# EAGLE design LB_BIT_o1_LED-v02(rev1) (EAGLE 6.1)

## Sheet 1 of 2
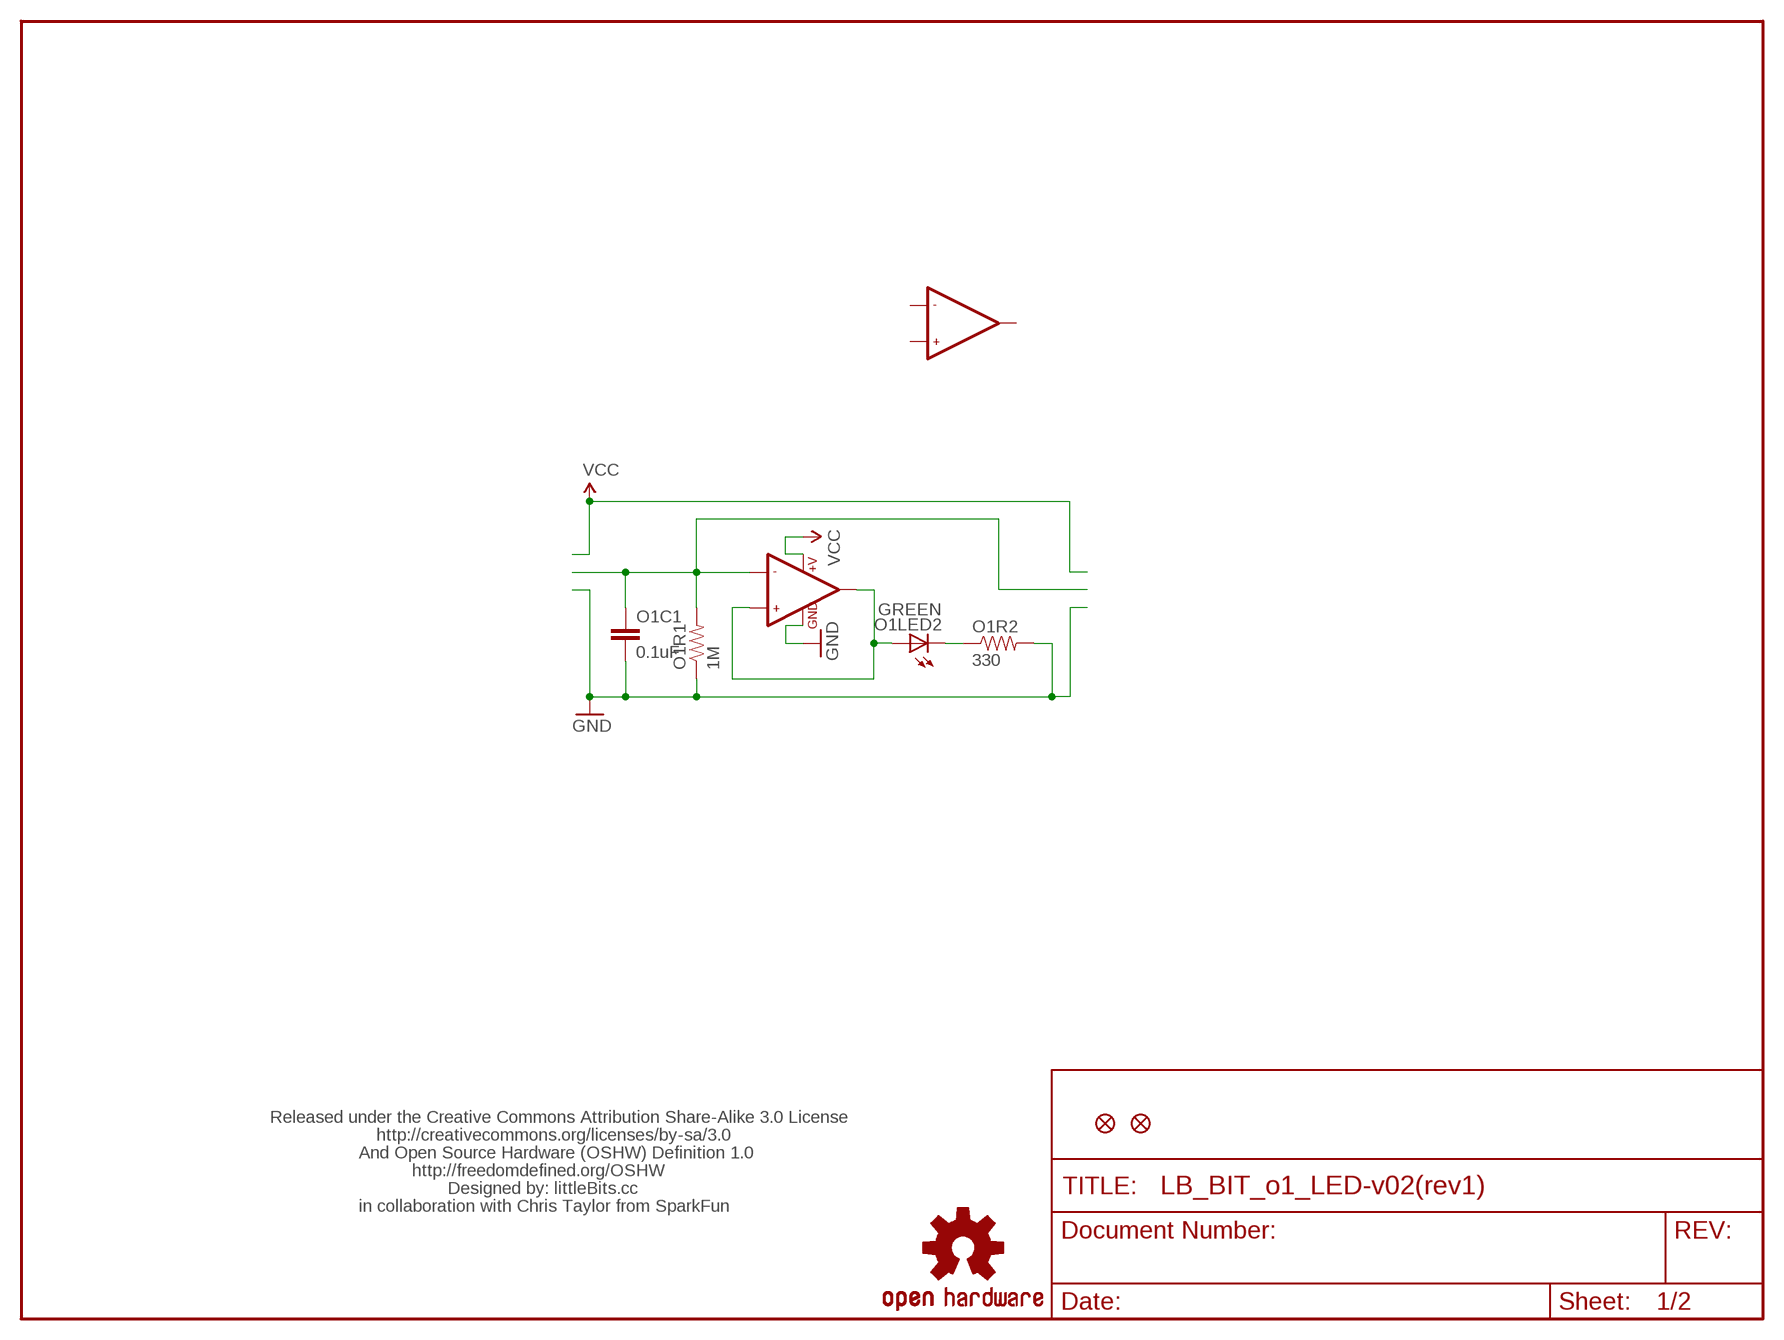
[diagram p0: schematic, sheet 1]

### Parts
JP1  FIDUCIAL1X2.5  [FIDUCIAL-1X2.5]
JP2  FIDUCIAL1X2.5  [FIDUCIAL-1X2.5]
O1C1  0.1uF  CAP1206  [1206]
O1LED2  GREEN  LED1206  [LED-1206]
O1R1  1M  RESISTOR  [0805]
O1R2  330  RESISTOR  [0805]
U$1  LB_CREDITS  [OSHWCREDIT]
U$3  OSHW-LOGOL  [OSHW-LOGO-L]
U$7  LMV358  [SO08]

### Nets
GND: O1C1.2 O1R1.1 O1R2.2 U$7.4(GND) ; also sheet 2
LEDGND: O1LED2.C O1R2.1
N$1: O1LED2.A U$7.1(OUT1) U$7.3(+IN1)
SIG: O1C1.1 O1R1.2 U$7.2(-IN1) ; also sheet 2
VCC: U$7.8(+V) ; also sheet 2
Unconnected: U$7.5(+IN2) U$7.6(-IN2) U$7.7(OUT2)

## Sheet 2 of 2
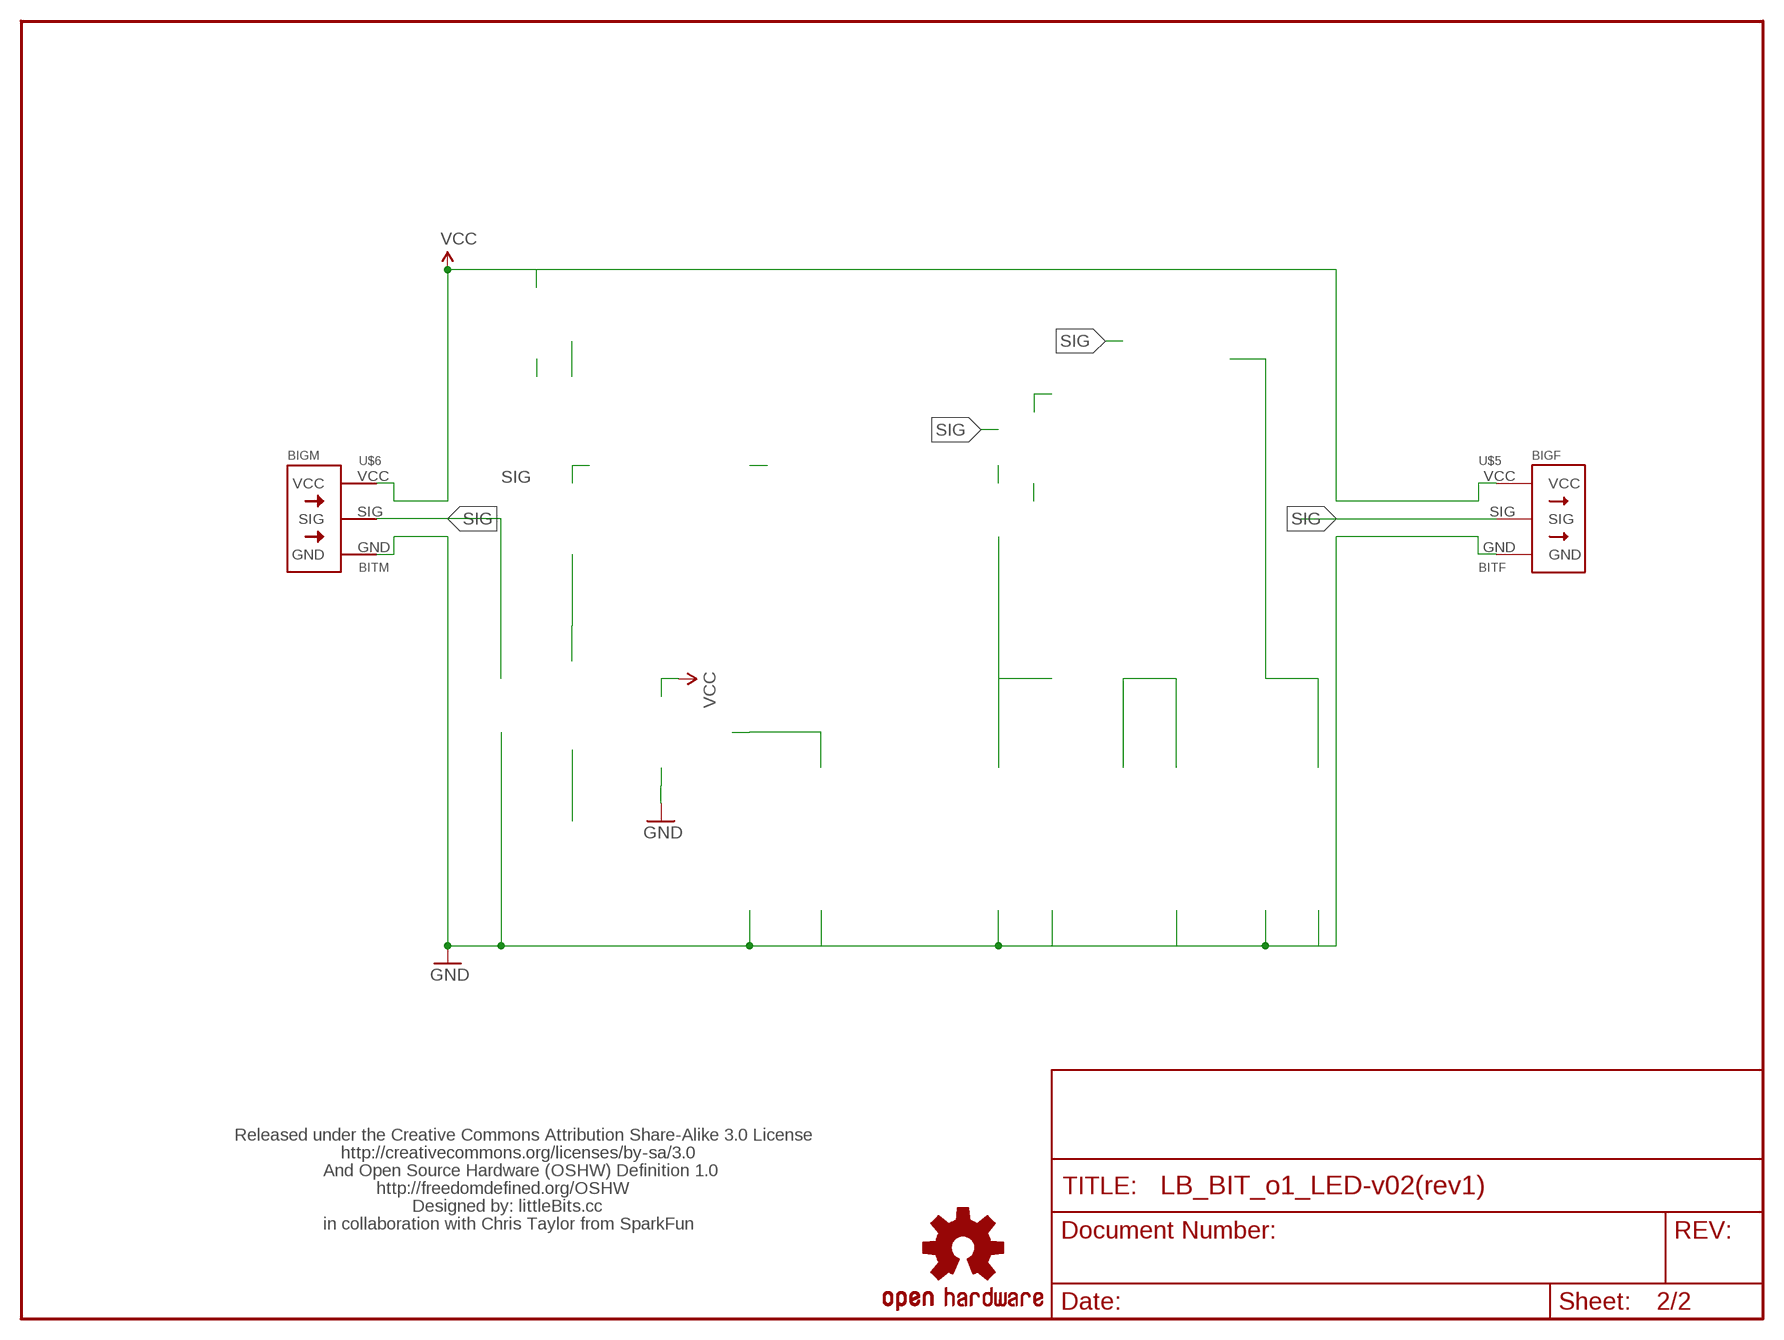
[diagram p1: schematic, sheet 2]

### Parts
U$2  OSHW-LOGOL  [OSHW-LOGO-L]
U$4  LB_CREDITS  [OSHWCREDIT]
U$5  BITF  [BITM]
U$6  BITM  [BITM]

### Nets
GND: U$5.GND U$6.GND ; also sheet 1
SIG: U$5.SIG U$6.SIG ; also sheet 1
VCC: U$5.VCC U$6.VCC ; also sheet 1

## Library data of the parts
JP1 JP2 = abes:FIDUCIAL: Fiducial Alignment Points Various fiducial points for machine vision alignment.
O1C1 = SparkFun:CAP: Capacitor Standard 0603 ceramic capacitor, and 0.1" leaded capacitor.
O1LED2 = SparkFun:LED: LEDs Standard schematic elements and footprints for 5mm, 3mm, 1206, and 0603 sized LEDs. 5mm - Spark Fun Electronics SKU : COM-00529 (and others)
O1R1 O1R2 = SparkFun:RESISTOR: Resistor Basic schematic elements and footprints for 0603, 1206, and PTH 1/10th watt (small) resistors.
U$1 U$4 = LITTLEBITS:LB_CREDITS
U$2 U$3 = SparkFun:OSHW-LOGO: Open Source Hardware Logo This logo indicates the piece of hardware it is found on incorporates a OSHW license and/or adheres to the definition of open source hardware found here: http://freedomdefined.org/OSHW
U$5 = _Rada:BITF
U$6 = _Rada:BITM
U$7 = SparkFun:LMV358

## Board
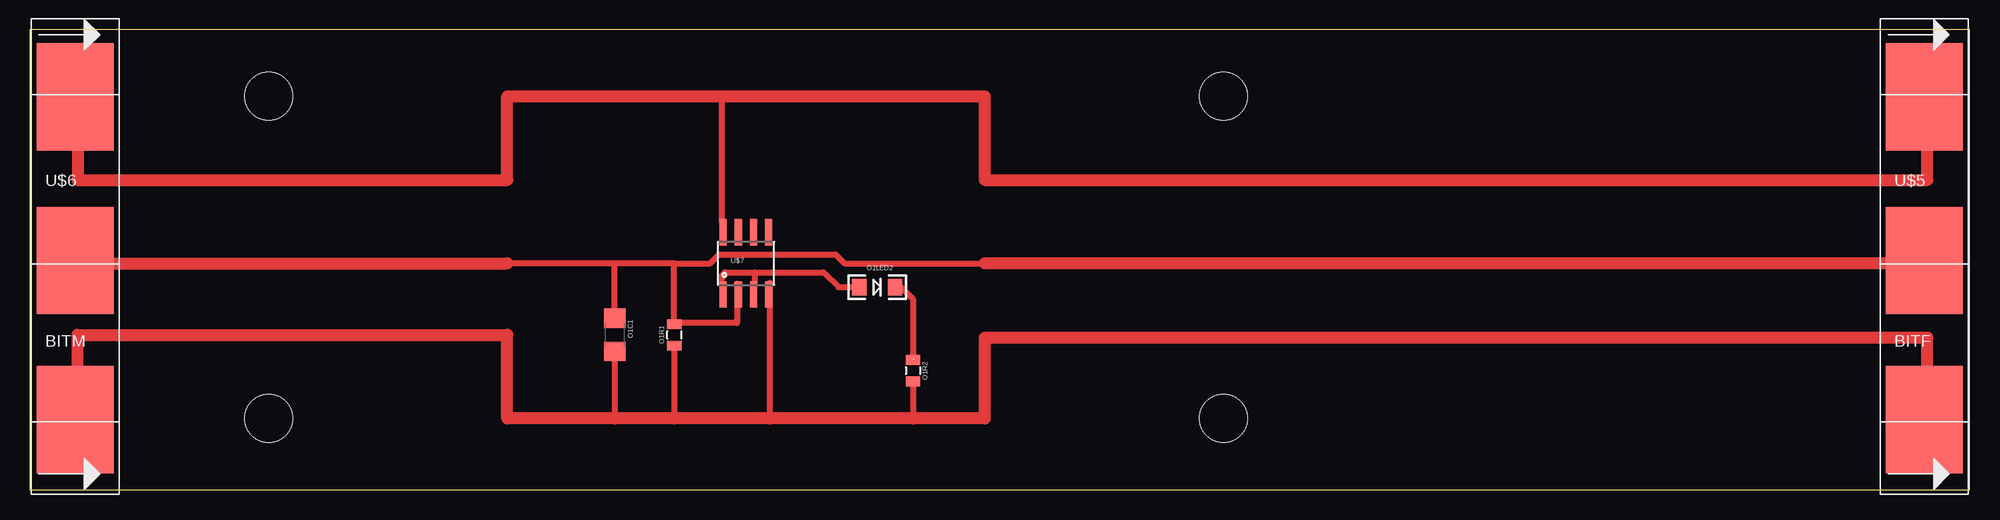
[diagram p2: board, top side]

Size 162.54 x 38.58 mm. Coordinates in mm from the lower left corner, seen from the top.
Outline: 0,0 162.54,0 162.54,38.58 0,38.58 0,0
Copper layers (1*16): Top 0.035mm / dielectric 1.5mm / Bottom 0.035mm
Design rules: minimum track width 10mil, minimum drill 24mil, track to track 8mil, track to pad 8mil, pad to pad 8mil, via to via 8mil, smd to smd 8mil, copper to edge 40mil, drill to drill 8mil, minimum pad ring 10mil, minimum via ring 8mil, stop-mask expansion 4mil, vias tented up to drill 0mil, thermal gap 10mil
Holes 4 mm at 20,33 20,6 100,33 100,6

### Footprints (pad centres in the part's own frame; a part is rotated, then mirrored left to right if it is on the bottom)
FIDUCIAL-1X2.5 = smd 0.635 x 0.635: 1 0,0
1206 = smd 1.6 x 1.8: 1 -1.4,0; 2 1.4,0
LED-1206 = smd 1.2 x 1.4: A -1.5,0; C 1.5,0
0805 = smd 0.8 x 1.2: 1 -0.9,0; 2 0.9,0
BITM = smd 6.452 x 8.992: GND 3.81,-13.145; SIG 3.81,0.191; VCC 3.81,13.906
SO08 = smd 0.61 x 2.21: 1 -1.905,-2.616; 2 -0.635,-2.616; 3 0.635,-2.616; 4 1.905,-2.616; 5 1.905,2.616; 6 0.635,2.616; 7 -0.635,2.616; 8 -1.905,2.616

### Placement (x,y rotation side)
JP1  -40.64,19.05 0 top  (outside the outline)
JP2  -43.18,19.05 0 top  (outside the outline)
O1C1  49,13 270 top
O1LED2  71,17 0 top
O1R1  54,13 90 top
O1R2  74,10 270 top
U$1  -48.26,1.27 0 top  (outside the outline)
U$2  -31.75,30.48 0 top  (outside the outline)
U$3  -16.51,20.32 0 top  (outside the outline)
U$4  -48.26,1.27 0 top  (outside the outline)
U$5  154.94,19.05 0 top
U$6  0,19.05 0 top
U$7  60,19 0 top

### Tracks (layer width: path | path; a pad name or v marks a point on that pad's centre or on a via)
GND
  Top 0.5: U$7.4 62,17.38 62,6 | O1C1.2 49,6 | O1R1.1 54,6 | O1R2.2 74,6
  Top 1: U$6.GND 4,5.91 4,13 40,13 40,6 49,6 54,6 62,6 74,6 80,6 80,12.75 159,12.75 159,5.91 U$5.GND
LEDGND  (1 unrouted)
  Top 0.5: O1LED2.C 73,17 74,16 74,11
N$1
  Top 0.5: U$7.1 58,17.38 58,18 58.25,18.25 60.75,18.25 | U$7.3 60.75,17.5 60.75,18.25 | 60.75,18.25 66.5,18.25 67.75,17 O1LED2.A
SIG
  Top 0.5: O1C1.1 49,19 | 49,19 40,19 | O1R1.2 54,14 | 54,14 54,19 | 54,19 49,19 | 54,19 57,19 57.75,19.75 67.5,19.75 68.25,19 80,19 | U$7.2 59.25,17.27 59.25,14 54,14
  Top 1: U$5.SIG 158.51,19 80,19 | U$6.SIG 4.05,19 40,19
VCC
  Top 0.5: U$7.8 58,22.62 58,33
  Top 1: U$6.VCC 4,32.96 4,26 40,26 40,33 58,33 80,33 80,26 159,26 159,33 158.75,33 U$5.VCC